# EasyEDA Pro project ProPrj_EPICS_Project_PCBs_2024-10-20.epro

# Schematic Schematic2
Create Date: 2024-09-29
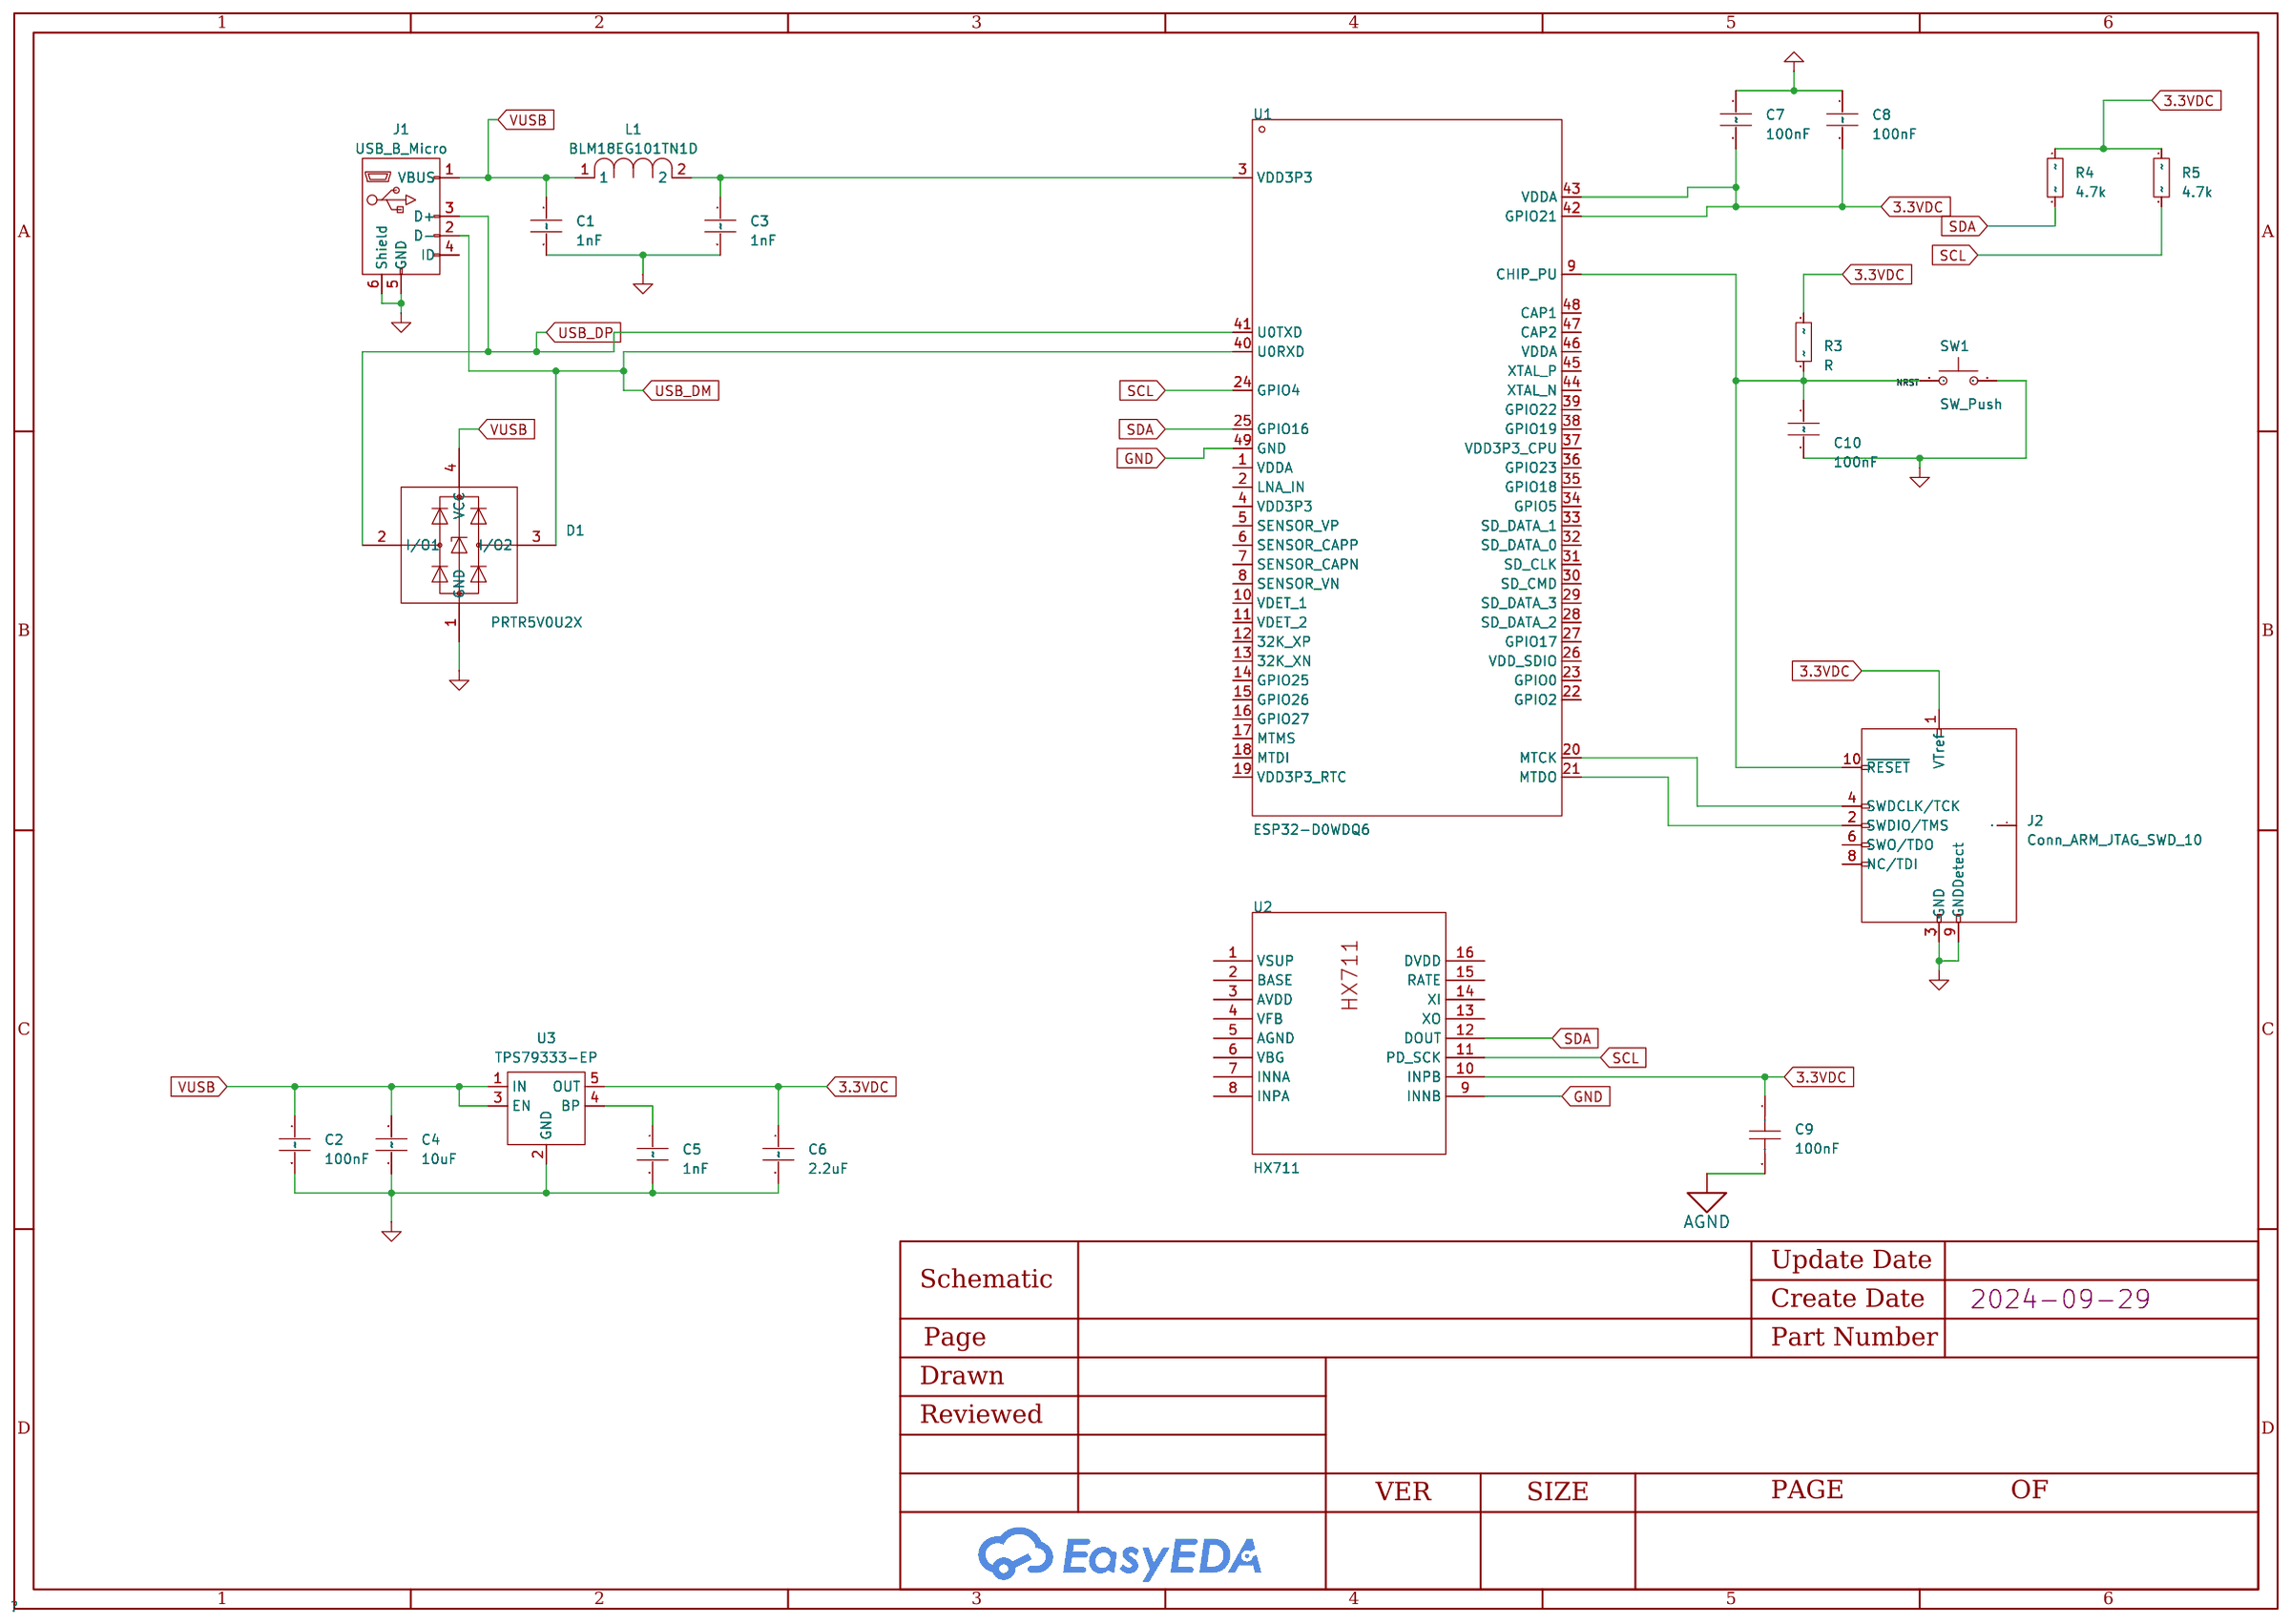
[diagram p0: schematic sheet]

## Parts
C1  1nF
C2  100nF
C3  1nF
C4  10uF
C5  1nF
C6  2.2uF
C7  100nF
C8  100nF
C9  100nF  [C0603]
C10  100nF
D1  PRTR5V0U2X
J1  USB_B_Micro
J2  Conn_ARM_JTAG_SWD_10
L1  BLM18EG101TN1D
R3  R
R4  4.7k
R5  4.7k
SW1  SW_Push
U1  -  [QFN-48_L6.0-W6.0-P0.40-BL-EP3.8]
U2  HX711  [SOP-16_L10.0-W3.9-P1.27-LS6.0-BL]
U3  TPS79333-EP

## Library data of the parts
C1-C8 C10 = Device_C
C9 = CAP_0603: Supplier Footprint: 0603
D1 = Power_Protection_PRTR5V0U2X: User doc link: https://assets.nexperia.com/documents/data-sheet/PRTR5V0U2X.pdf
J1 = Connector_USB_B_Micro
J2 = Connector_Conn_ARM_JTAG_SWD_10: User doc link: http://infocenter.arm.com/help/topic/com.arm.doc.ddi0314h/DDI0314H_coresight_components_trm.pdf
L1 = COURSE_COMPONENTS_BLM18EG101TN1D
R3-R5 = Device_R
SW1 = Switch_SW_Push
U1 = ESP32-D0WDQ6: Frequency Range:2.4GHz Frequency Range:2.4GHz Interface:I2C,I2S,SPI,UART Operating Voltage:2.3V~3.6V Operating Voltage:2.3V~3.6V Applications:蓝牙,WiFi Output Power:20dBm Data Rate:150Mbps Current Of Transmitting:240mA Sensitivity:-98dBm Receive Current:100; Supplier Part: C129733; Manufacturer: ESPRESSIF(乐鑫); Supplier Footprint: QFN-48-EP(6x6); JLCPCB Part Class: Extended Part; Datasheet: https://atta.szlcsc.com/upload/public/pdf/source/20180207/C129733_15179947908541359020.pdf; Supplier: LCSC; Frequency Range: 2.4GHz; Interface: I2C,I2S,SPI,UART; Operating Voltage: 2.3V~3.6V; Applications: 蓝牙,WiFi; Output Power: 20dBm; Data Rate: 150Mbps; Current Of Transmitting: 240mA; Sensitivity: -98dBm; Receive Current: 100mA; Operating Temperature: -40℃~+125℃
U2 = HX711: Supplier Part: C43656; Manufacturer: AVIA(海芯科技); Supplier Footprint: SOP-16; JLCPCB Part Class: Extended Part; Datasheet: https://atta.szlcsc.com/upload/public/pdf/source/20201105/C43656_14FD91CAE53E7DB415D03EABCB162D83.pdf; Supplier: LCSC
U3 = Regulator_Linear_TPS79333-EP: User doc link: http://www.ti.com/lit/ds/symlink/tps79333-ep.pdf

## Nets
3.3VDC: C6.1 C7.1 C8.1 C9.1 J2.1(VTref) R3.1 R4.1 R5.1 U1.42(GPIO21) U1.43(VDDA) U2.10(INPB) U3.5(OUT)
AGND: C9.2
GND: U1.49(GND) U2.9(INNB)
NRST: C10.2 J2.10(~{RESET}) R3.2 SW1.1 U1.9(CHIP_PU)
POWER_GND: C1.2 C2.2 C3.2 C4.2 C5.2 C6.2 C7.2 C8.2 C10.1 D1.1(GND) J1.5(GND) J1.6(Shield) J2.3(GND) J2.5(GND) J2.9(GNDDetect) SW1.2 U3.2(GND)
SCL: R5.2 U1.24(GPIO4) U2.11(PD_SCK)
SDA: R4.2 U1.25(GPIO16) U2.12(DOUT)
USB_DM: D1.3(I/O2) J1.2(D-) U1.40(U0RXD)
USB_DP: D1.2(I/O1) J1.3(D+) U1.41(U0TXD)
VUSB: C1.1 C2.1 C4.1 D1.4(VCC) J1.1(VBUS) L1.1 U3.1(IN) U3.3(EN)
Net-(C3-1): C3.1 L1.2 U1.3(VDD3P3)
Net-(C5-1): C5.1 U3.4(BP)
Net-(J2-2): J2.2(SWDIO/TMS) U1.21(MTDO)
Net-(J2-4): J2.4(SWDCLK/TCK) U1.20(MTCK)

Not connected (* = marked no-connect by the designer): J1 4(ID); J2 6(SWO/TDO) 7(KEY) 8(NC/TDI); U1 1(VDDA) 2(LNA_IN) 4(VDD3P3) 5(SENSOR_VP) 6(SENSOR_CAPP) 7(SENSOR_CAPN) 8(SENSOR_VN) 10(VDET_1) 11(VDET_2) 12(32K_XP) 13(32K_XN) 14(GPIO25) 15(GPIO26) 16(GPIO27) 17(MTMS) 18(MTDI) 19(VDD3P3_RTC) 22(GPIO2) 23(GPIO0) 26(VDD_SDIO) 27(GPIO17) 28(SD_DATA_2) 29(SD_DATA_3) 30(SD_CMD) 31(SD_CLK) 32(SD_DATA_0) 33(SD_DATA_1) 34(GPIO5) 35(GPIO18) 36(GPIO23) 37(VDD3P3_CPU) 38(GPIO19) 39(GPIO22) 44(XTAL_N) 45(XTAL_P) 46(VDDA) 47(CAP2) 48(CAP1); U2 1(VSUP) 2(BASE) 3(AVDD) 4(VFB) 5(AGND) 6(VBG) 7(INNA) 8(INPA) 13(XO) 14(XI) 15(RATE) 16(DVDD)
